# EAGLE design psu_testboard_v1 (1) (1) (EAGLE 6.5.0)

## Sheet 1 of 6
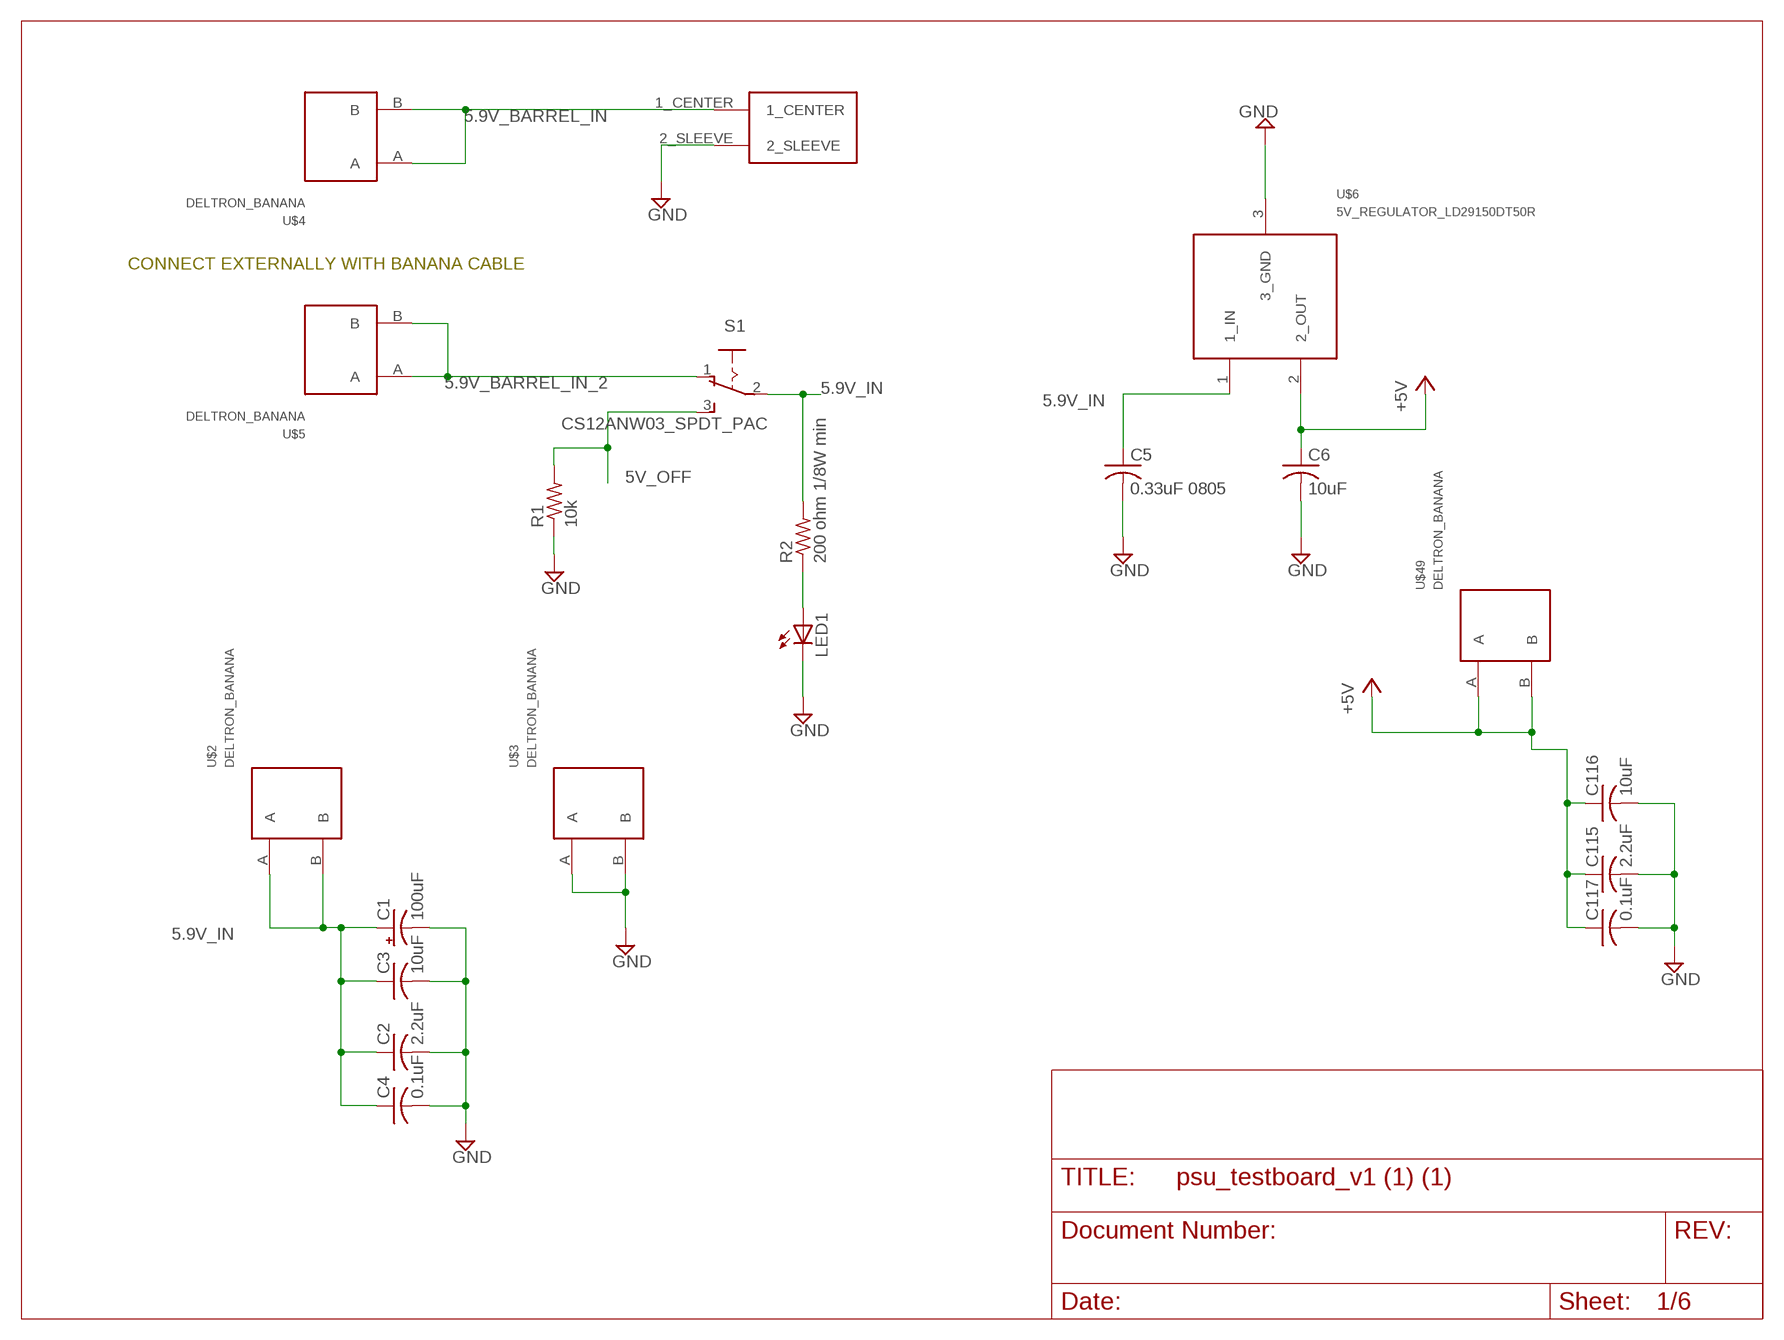
[diagram p0: schematic, sheet 1]

### Parts
C1  100uF  CAP_POL_DEV  [CAP_POL_RADIAL_8MM_3P5MMPAD]
C2  2.2uF  C-USC0603  [C0603]
C3  10uF  C-USC1206  [C1206]
C4  0.1uF  C-USC0603  [C0603]
C5  0.33uF 0805  C-USC0805  [C0805]
C6  10uF  5MM_ELECTROLYTIC_SMT_CAP_EEE-1VA100SR  [5MM_SMT_ELECTROLYTICCAP_PANASONIC]
C115  2.2uF  C-USC0603  [C0603]
C116  10uF  C-USC1206  [C1206]
C117  0.1uF  C-USC0603  [C0603]
LED1  LED3MM  [LED3MM]
R1  10k  R-US_R0603  [R0603]
R2  200 ohm 1/8W min  R-US_R0603  [R0603]
S1  CS12ANW03_SPDT_PAC  [CS12ANW03_NKK_SPDT_SLIDESWITCH_PAC]
U$1  BARREL_JACK_PJ-037A  [BARREL_JACK_PJ-037A]
U$2  DELTRON_BANANA  [DELTRON_BANANA]
U$3  DELTRON_BANANA  [DELTRON_BANANA]
U$4  DELTRON_BANANA  [DELTRON_BANANA]
U$5  DELTRON_BANANA  [DELTRON_BANANA]
U$6  5V_REGULATOR_LD29150DT50R  [DPAK]
U$49  DELTRON_BANANA  [DELTRON_BANANA]

### Nets
5.9V_BARREL_IN: U$1.1_CENTER U$4.A U$4.B
5.9V_BARREL_IN_2: S1.1 U$5.A U$5.B
5.9V_IN: C1.PIN+ C2.1 C3.1 C4.1 C5.1 R2.2 S1.2 U$2.A U$2.B U$6.1(1_IN) ; also sheet 3,4,5
5V_OFF: R1.2 S1.3
+5V: C6.1+ C115.1 C116.1 C117.1 U$6.2(2_OUT) U$49.A U$49.B ; also sheet 3,6
GND: C1.PIN- C2.2 C3.2 C4.2 C5.2 C6.2- C115.2 C116.2 C117.2 LED1.K(C) R1.1 U$1.2_SLEEVE U$3.A U$3.B U$6.3(3_GND) ; also sheet 2,3,4,5,6
N$1: LED1.A R2.1

### Notes on the sheet
- CONNECT EXTERNALLY WITH BANANA CABLE

## Sheet 2 of 6
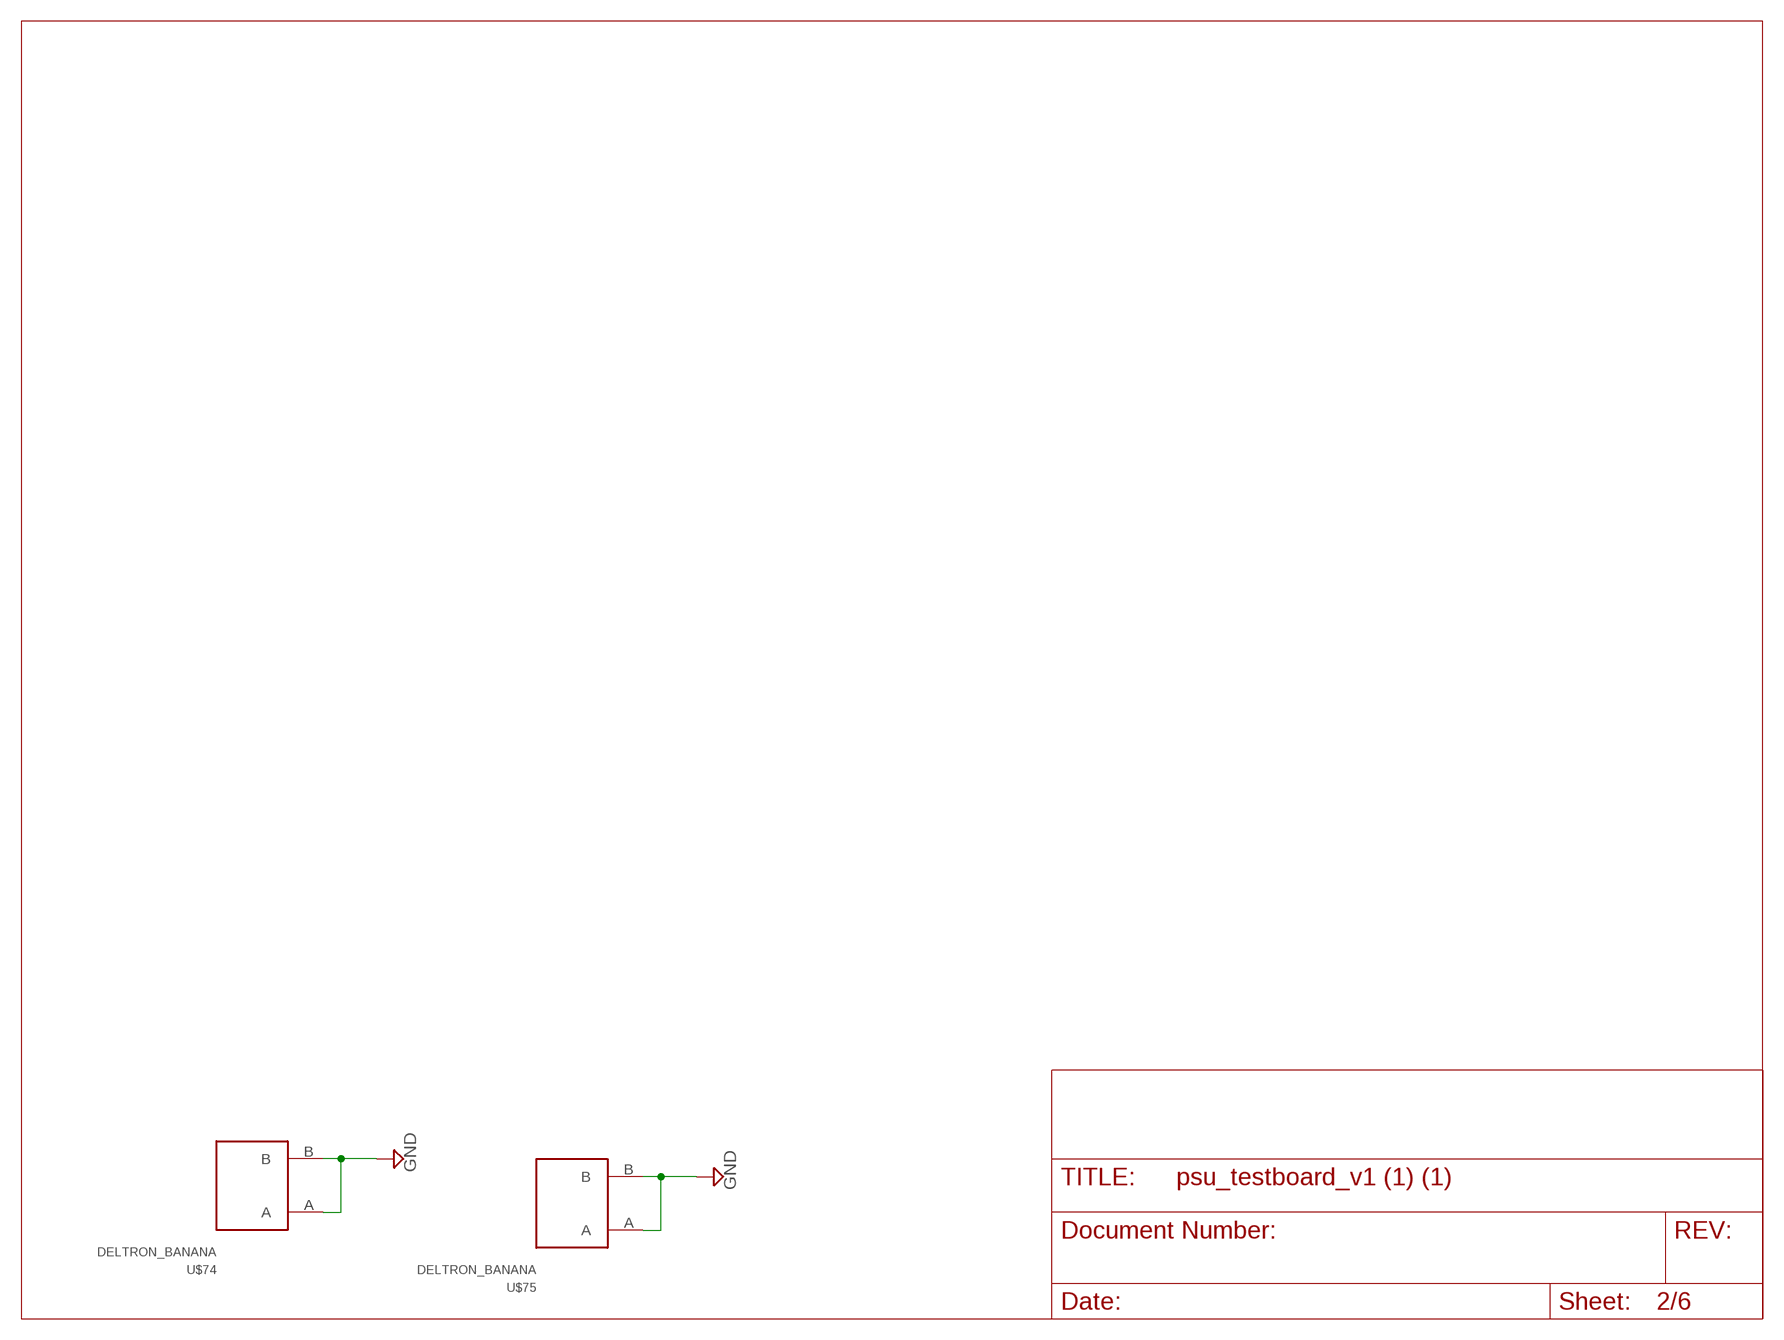
[diagram p1: schematic, sheet 2]

### Parts
U$74  DELTRON_BANANA  [DELTRON_BANANA]
U$75  DELTRON_BANANA  [DELTRON_BANANA]

### Nets
GND: U$74.A U$74.B U$75.A U$75.B ; also sheet 1,3,4,5,6

## Sheet 3 of 6
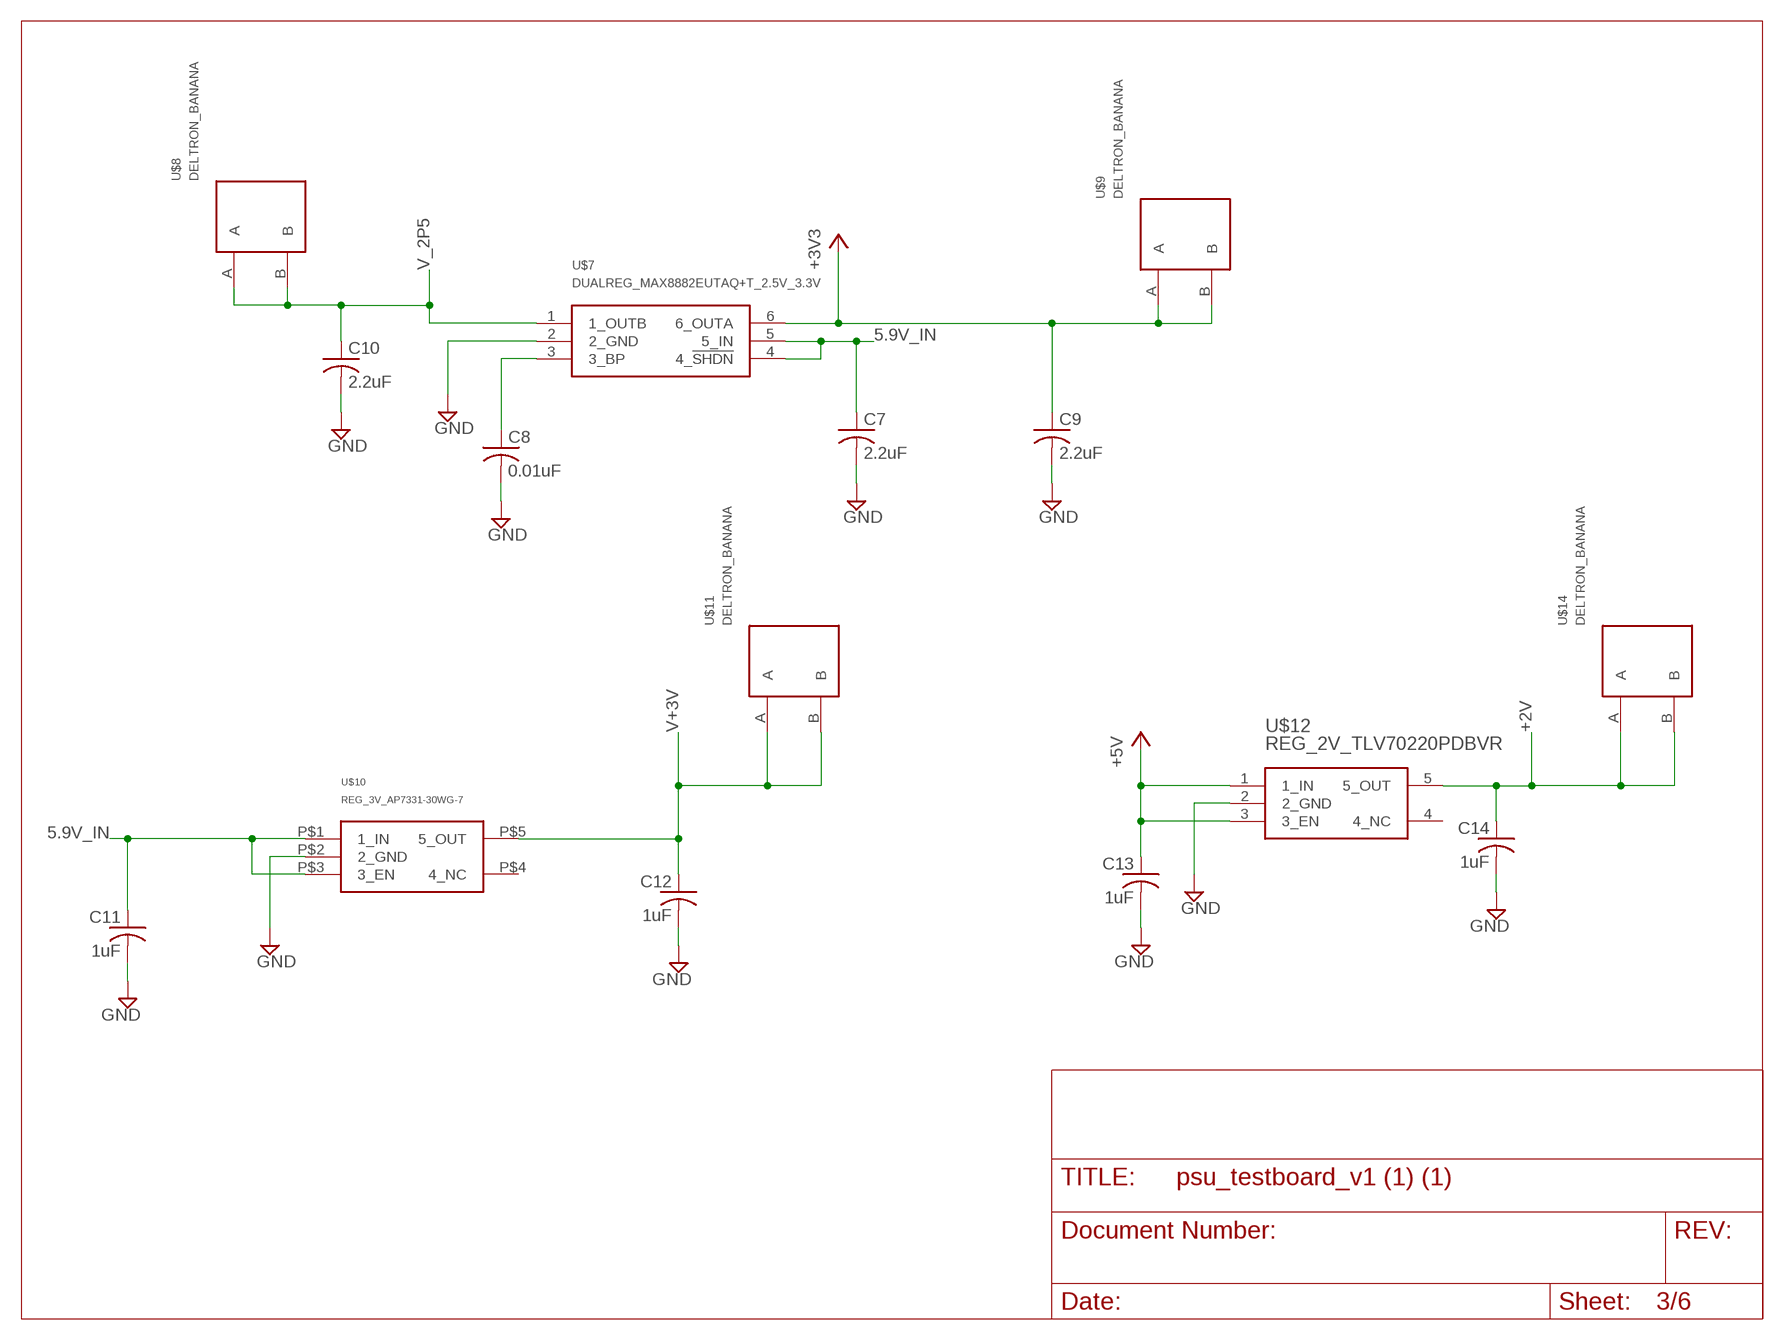
[diagram p2: schematic, sheet 3]

### Parts
C7  2.2uF  C-USC0603  [C0603]
C8  0.01uF  C-USC0603  [C0603]
C9  2.2uF  C-USC0603  [C0603]
C10  2.2uF  C-USC0603  [C0603]
C11  1uF  C-USC0603  [C0603]
C12  1uF  C-USC0603  [C0603]
C13  1uF  C-USC0603  [C0603]
C14  1uF  C-USC0603  [C0603]
U$7  DUALREG_MAX8882EUTAQ+T_2.5V_3.3V  [SOT23-6]
U$8  DELTRON_BANANA  [DELTRON_BANANA]
U$9  DELTRON_BANANA  [DELTRON_BANANA]
U$10  REG_3V_AP7331-30WG-7  [SOT-25]
U$11  DELTRON_BANANA  [DELTRON_BANANA]
U$12  REG_2V_TLV70220PDBVR  [SOT23-5]
U$14  DELTRON_BANANA  [DELTRON_BANANA]

### Nets
5.9V_IN: C7.1 C11.1 U$7.4(4_!SHDN) U$7.5(5_IN) U$10.P$1(1_IN) U$10.P$3(3_EN) ; also sheet 1,4,5
+2V: C14.1 U$12.5(5_OUT) U$14.A U$14.B
+3V3: C9.1 U$7.6(6_OUTA) U$9.A U$9.B ; also sheet 5
+5V: C13.1 U$12.1(1_IN) U$12.3(3_EN) ; also sheet 1,6
GND: C7.2 C8.2 C9.2 C10.2 C11.2 C12.2 C13.2 C14.2 U$7.2(2_GND) U$10.P$2(2_GND) U$12.2(2_GND) ; also sheet 1,2,4,5,6
N$3: C8.1 U$7.3(3_BP)
V+3V: C12.1 U$10.P$5(5_OUT) U$11.A U$11.B
V_2P5: C10.1 U$7.1(1_OUTB) U$8.A U$8.B
Unconnected: U$10.P$4(4_NC) U$12.4(4_NC)

## Sheet 4 of 6
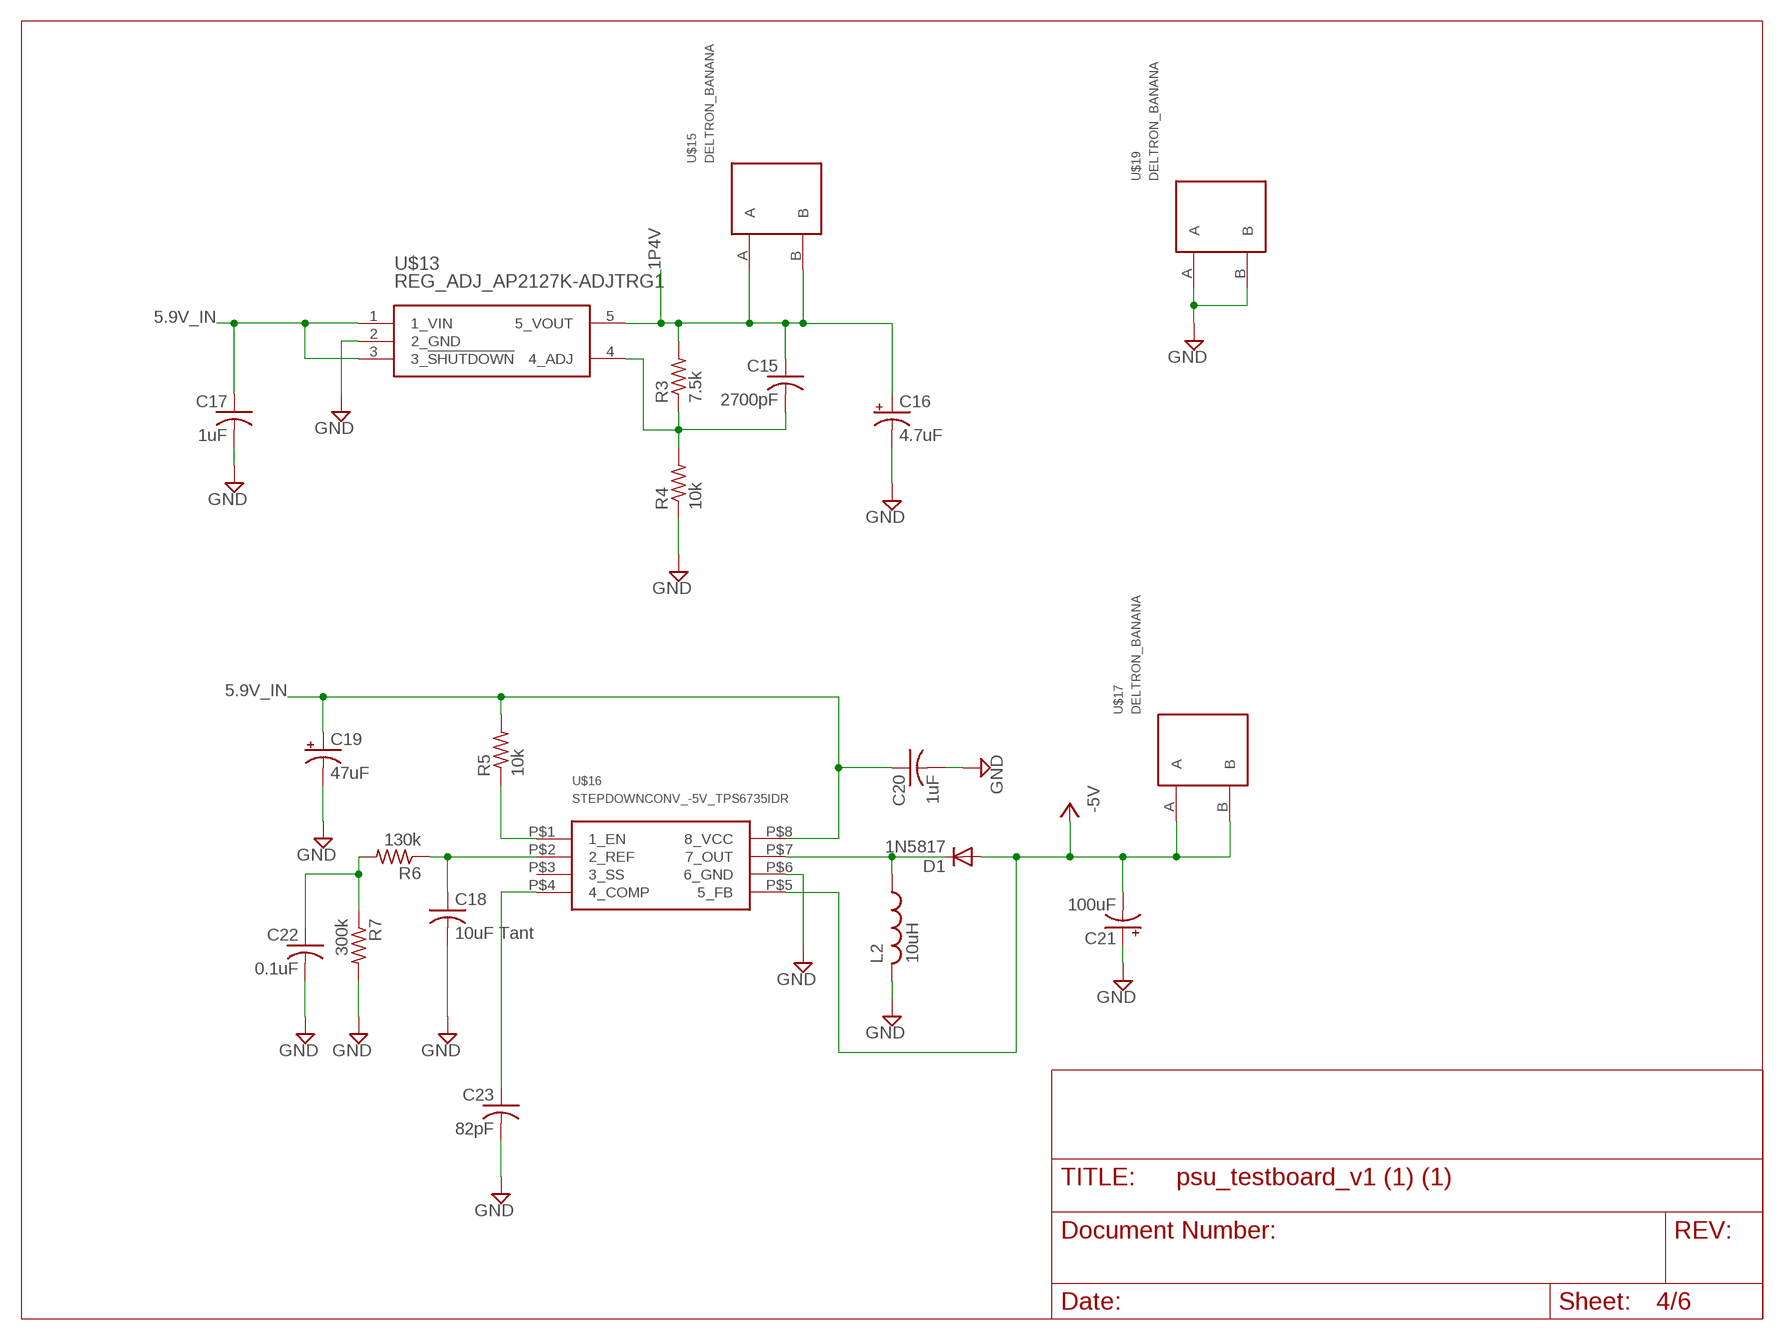
[diagram p3: schematic, sheet 4]

### Parts
C15  2700pF  C-USC0603  [C0603]
C16  4.7uF  CPOL-USE2.5-4V  [E2,5RE]
C17  1uF  C-USC0603  [C0603]
C18  10uF Tant  C-USC1206  [C1206]
C19  47uF  CPOL-USE5-10.5  [E5-10,5]
C20  1uF  C-USC0603  [C0603]
C21  100uF  CPOL-USE2.5-7  [E2,5-7]
C22  0.1uF  C-USC0603  [C0603]
C23  82pF  C-USC0603  [C0603]
D1  1N5817  DIODE1N4148  [DIODE-1N4148]
L2  10uH  COILCRAFT_10UHIND_DO1608C-103MLB  [COILCRAFT_POWERIND_DO1608C-103MLB]
R3  7.5k  R-US_R0603  [R0603]
R4  10k  R-US_R0603  [R0603]
R5  10k  R-US_R0603  [R0603]
R6  130k  R-US_R0603  [R0603]
R7  300k  R-US_R0603  [R0603]
U$13  REG_ADJ_AP2127K-ADJTRG1  [SOT23-5]
U$15  DELTRON_BANANA  [DELTRON_BANANA]
U$16  STEPDOWNCONV_-5V_TPS6735IDR  [SOIC8]
U$17  DELTRON_BANANA  [DELTRON_BANANA]
U$19  DELTRON_BANANA  [DELTRON_BANANA]

### Nets
1P4V: C15.1 C16.+ R3.2 U$13.5(5_VOUT) U$15.A U$15.B
5.9V_IN: C17.1 C19.+ C20.1 R5.2 U$13.1(1_VIN) U$13.3(3_!SHUTDOWN) U$16.P$8(8_VCC) ; also sheet 1,3,5
-5V: C21.- D1.A U$16.P$5(5_FB) U$17.A U$17.B ; also sheet 5
GND: C16.- C17.2 C18.2 C19.- C20.2 C21.+ C22.2 C23.2 L2.P$2 R4.1 R7.2 U$13.2(2_GND) U$16.P$6(6_GND) U$19.A U$19.B ; also sheet 1,2,3,5,6
N$2: D1.C L2.P$1 U$16.P$7(7_OUT)
N$4: C15.2 R3.1 R4.2 U$13.4(4_ADJ)
N$5: R5.1 U$16.P$1(1_EN)
N$6: C22.1 R6.2 R7.1
N$7: C18.1 R6.1 U$16.P$2(2_REF)
N$8: C23.1 U$16.P$4(4_COMP)
Unconnected: U$16.P$3(3_SS)

## Sheet 5 of 6
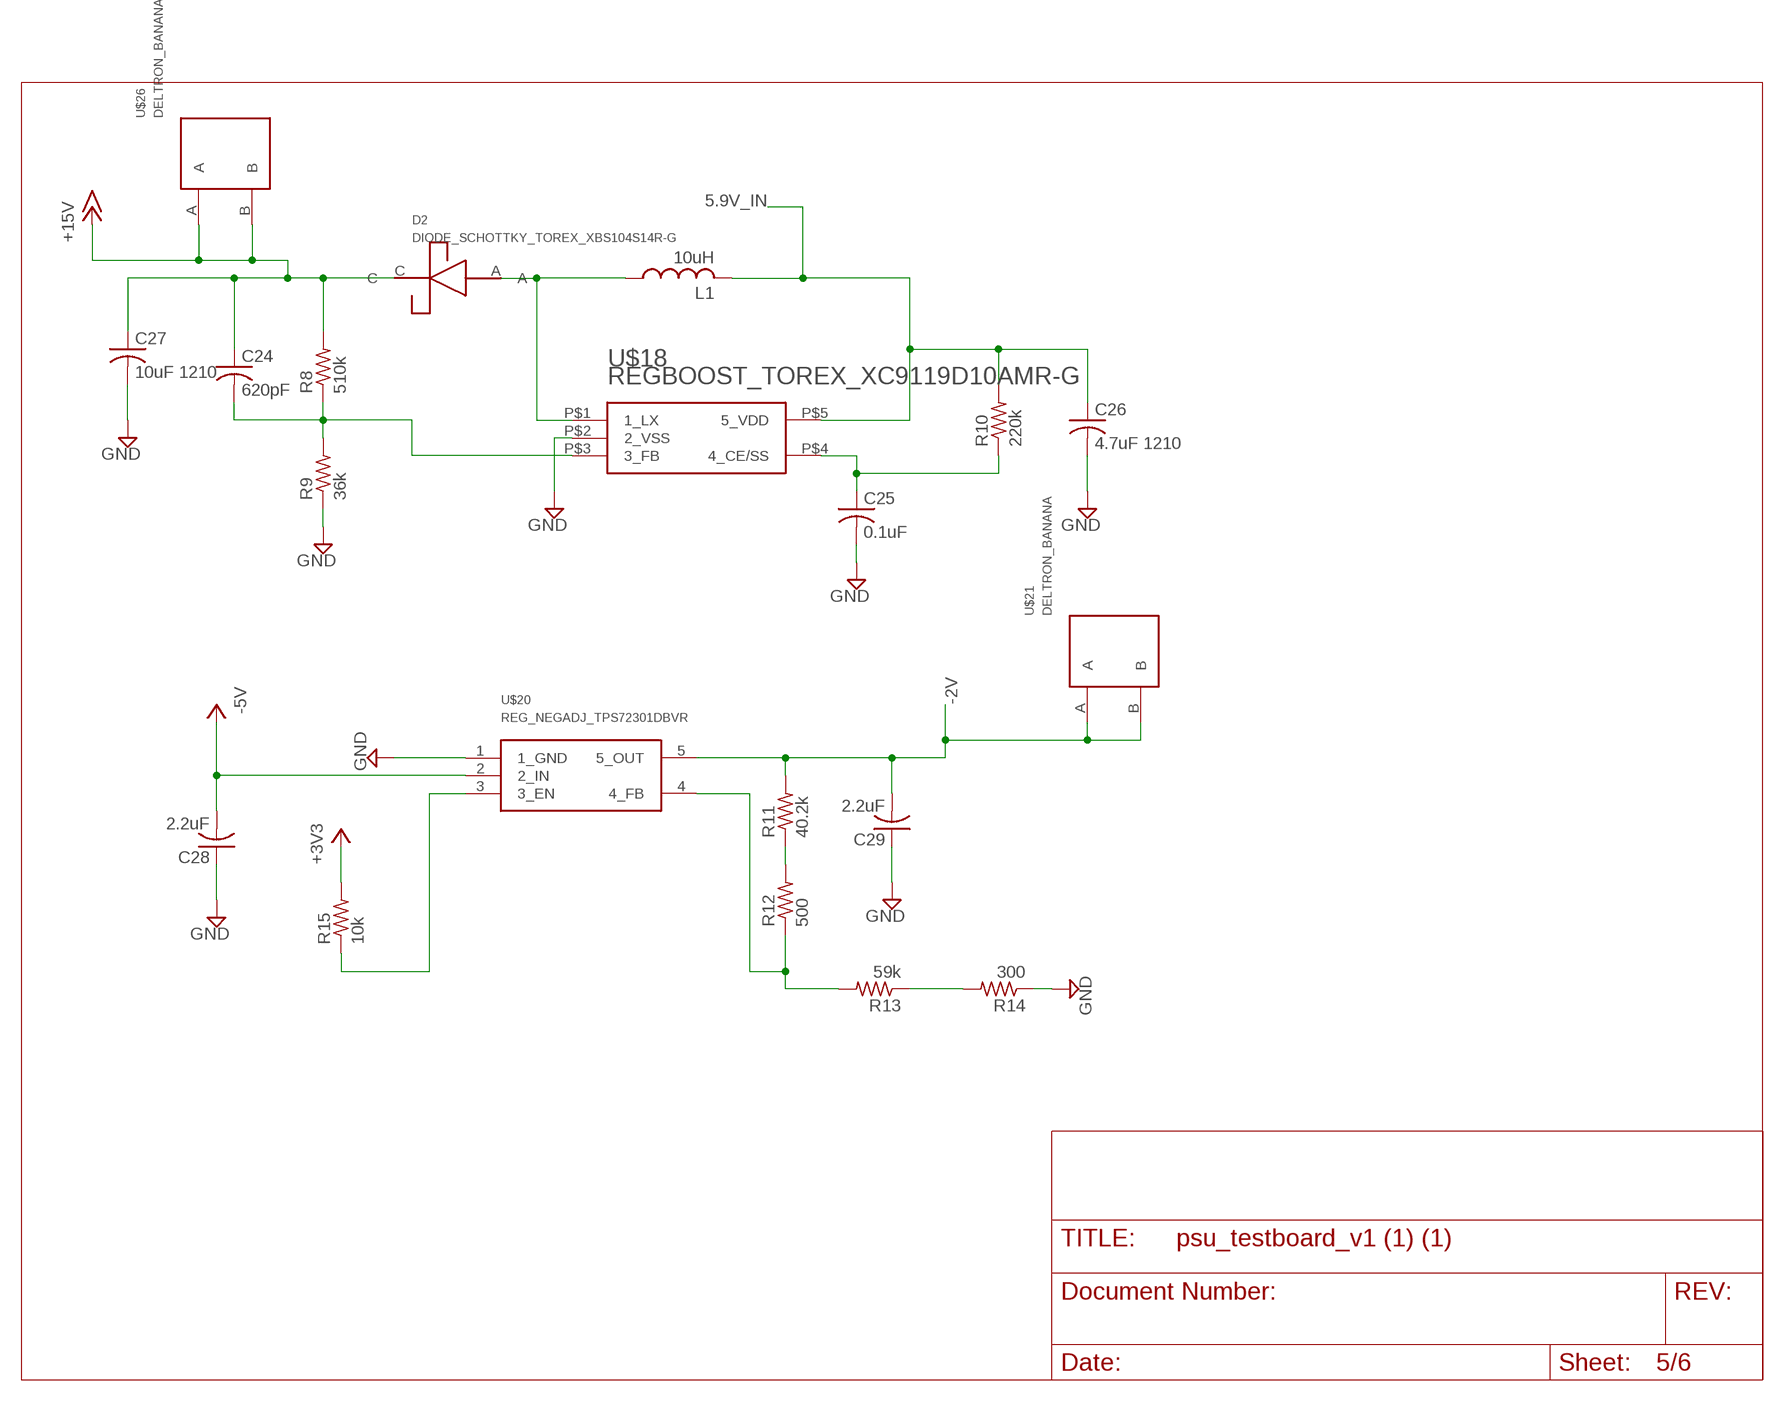
[diagram p4: schematic, sheet 5]

### Parts
C24  620pF  C-USC0603  [C0603]
C25  0.1uF  C-USC0603  [C0603]
C26  4.7uF 1210  C-USC1210  [C1210]
C27  10uF 1210  C-USC1210  [C1210]
C28  2.2uF  C-USC0603  [C0603]
C29  2.2uF  C-USC0603  [C0603]
D2  DIODE_SCHOTTKY_TOREX_XBS104S14R-G  [SOD-123A]
L1  10uH  SUMIDA_10UH_IND_CDRH4D18CNP-100PC  [SUMIDA_INDUCTOR_CDRH4D18CNP-100PC]
R8  510k  R-US_R0603  [R0603]
R9  36k  R-US_R0603  [R0603]
R10  220k  R-US_R0603  [R0603]
R11  40.2k  R-US_R0603  [R0603]
R12  500  R-US_R0603  [R0603]
R13  59k  R-US_R0603  [R0603]
R14  300  R-US_R0603  [R0603]
R15  10k  R-US_R0603  [R0603]
U$18  REGBOOST_TOREX_XC9119D10AMR-G  [SOT25-5]
U$20  REG_NEGADJ_TPS72301DBVR  [SOT23-5]
U$21  DELTRON_BANANA  [DELTRON_BANANA]
U$26  DELTRON_BANANA  [DELTRON_BANANA]

### Nets
5.9V_IN: C26.1 L1.P$2 R10.2 U$18.P$5(5_VDD) ; also sheet 1,3,4
+3V3: R15.2 ; also sheet 3
+15V: C24.1 C27.1 D2.C R8.2 U$26.A U$26.B
-2V: C29.2 R11.2 U$20.5(5_OUT) U$21.A U$21.B
-5V: C28.2 U$20.2(2_IN) ; also sheet 4
GND: C25.2 C26.2 C27.2 C28.1 C29.1 R9.1 R14.1 U$18.P$2(2_VSS) U$20.1(1_GND) ; also sheet 1,2,3,4,6
N$9: R13.1 R14.2
N$10: D2.A L1.P$1 U$18.P$1(1_LX)
N$12: C24.2 R8.1 R9.2 U$18.P$3(3_FB)
N$13: R12.1 R13.2 U$20.4(4_FB)
N$14: C25.1 R10.1 U$18.P$4(4_CE/SS)
N$15: R11.1 R12.2
N$16: R15.1 U$20.3(3_EN)

## Sheet 6 of 6
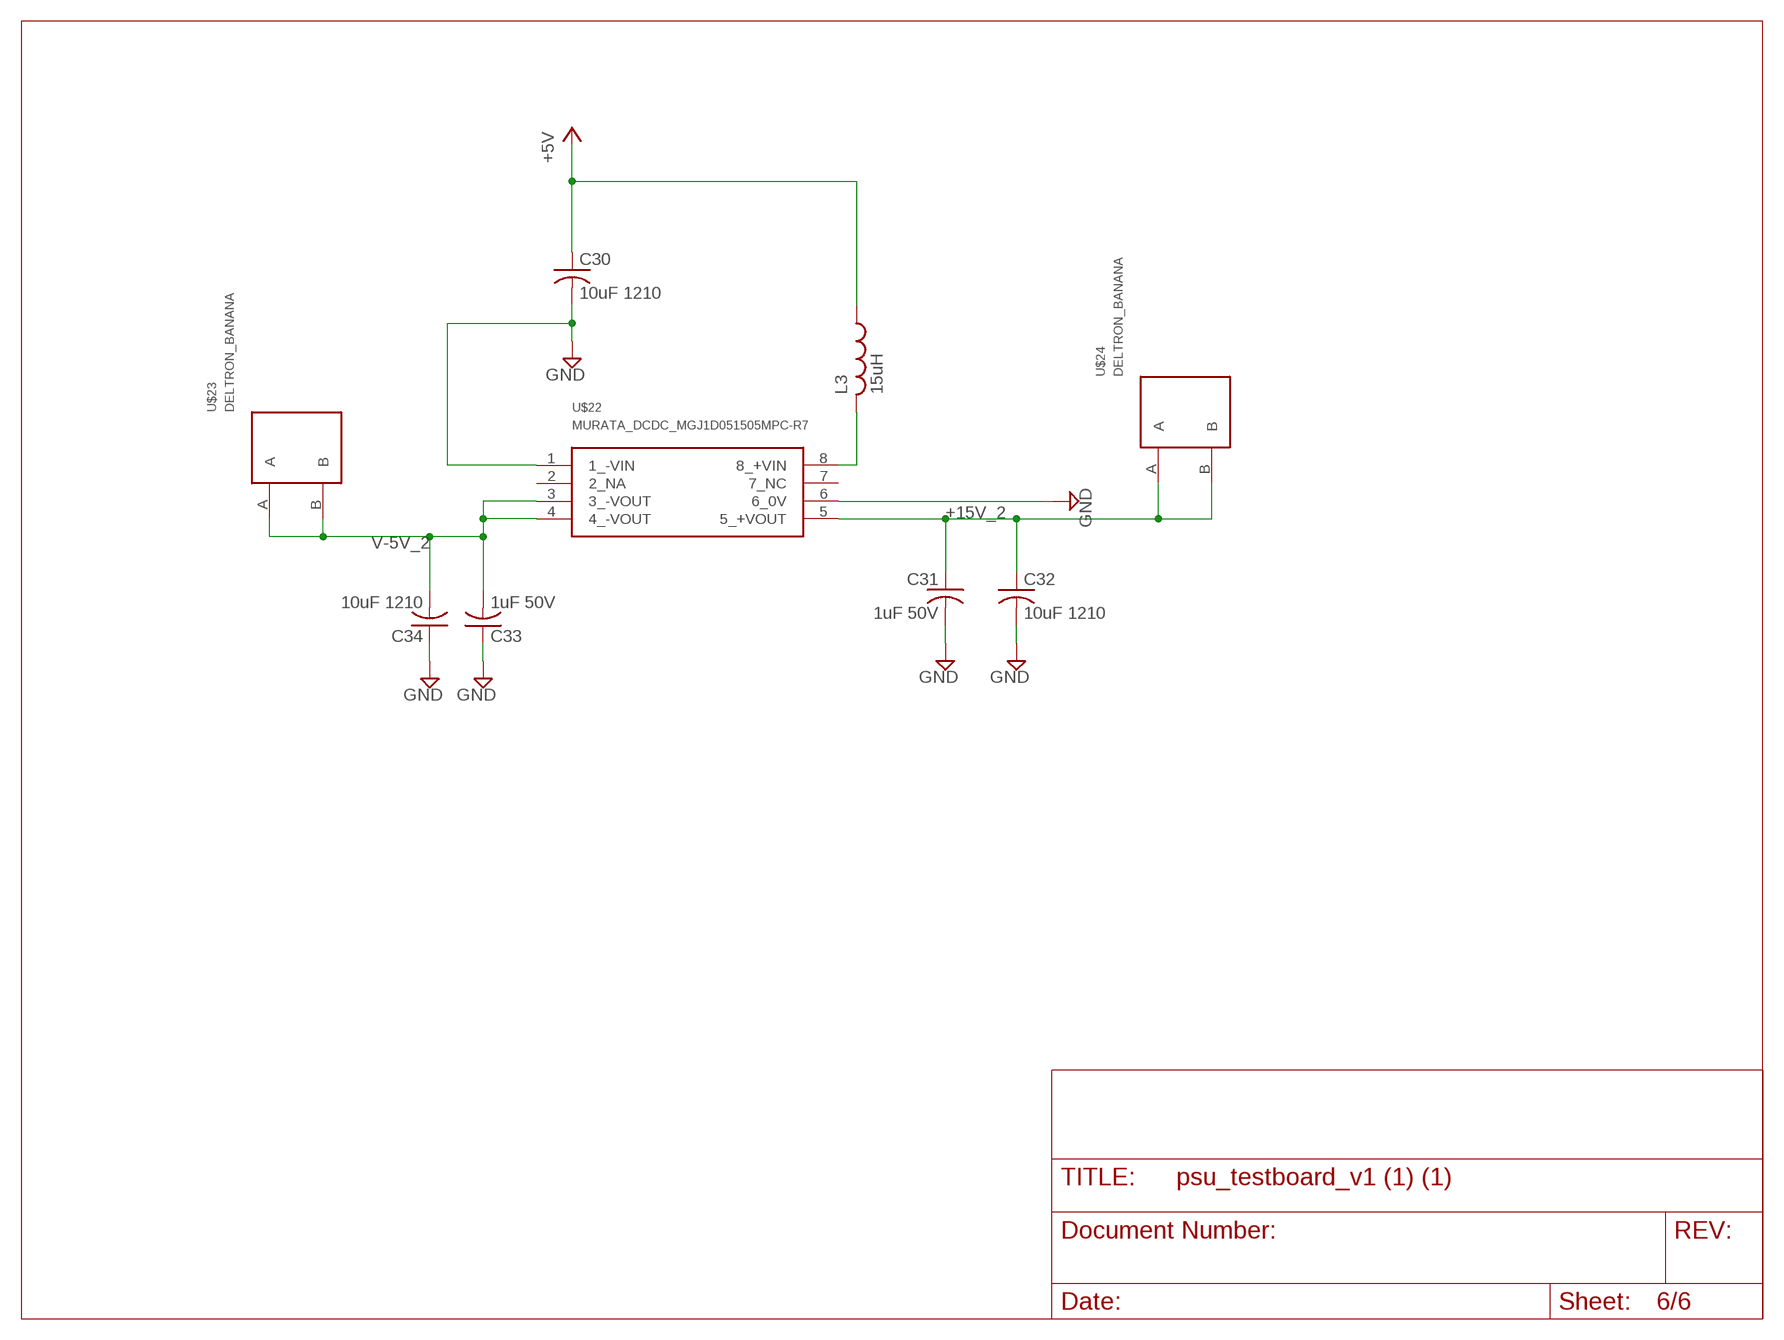
[diagram p5: schematic, sheet 6]

### Parts
C30  10uF 1210  C-USC1210  [C1210]
C31  1uF 50V  C-USC0603  [C0603]
C32  10uF 1210  C-USC1210  [C1210]
C33  1uF 50V  C-USC0603  [C0603]
C34  10uF 1210  C-USC1210  [C1210]
L3  15uH  L-US0207/5V  [0207/5V]
U$22  MURATA_DCDC_MGJ1D051505MPC-R7  [MURATA_DCDC_MGJ1D051505MPC-R7]
U$23  DELTRON_BANANA  [DELTRON_BANANA]
U$24  DELTRON_BANANA  [DELTRON_BANANA]

### Nets
+5V: C30.1 L3.1 ; also sheet 1,3
+15V_2: C31.1 C32.1 U$22.5(5_+VOUT) U$24.A U$24.B
GND: C30.2 C31.2 C32.2 C33.1 C34.1 U$22.1(1_-VIN) U$22.6(6_0V) ; also sheet 1,2,3,4,5
N$17: L3.2 U$22.8(8_+VIN)
V-5V_2: C33.2 C34.2 U$22.3(3_-VOUT) U$22.4(4_-VOUT) U$23.A U$23.B
Unconnected: U$22.2(2_NA) U$22.7(7_NC)

## Library data of the parts
C1 = RF_servo_SA032212:CAP_POL_DEV: Polarized Capacitor Created on : 03.24.2012 Created by: Serhan Ardanuc
C2-C5 C7-C15 C17 C18 C20 C22-C34 C115-C117 = rcl:C-US: CAPACITOR, American symbol
C6 = fp64v2lib:5MM_ELECTROLYTIC_SMT_CAP_EEE-1VA100SR
C16 C19 C21 = rcl:CPOL-US: POLARIZED CAPACITOR, American symbol
D1 = SparkFun:DIODE: Diode These are standard reverse protection diodes and small signal diodes. SMA package can handle up to about 1A. SOD-323 can handle about 200mA. What the SOD-323 package when ordering, there are some mfgs out there that are 5-pin packages.
D2 = fp64v2lib:DIODE_SCHOTTKY_TOREX_XBS104S14R-G: Mouser part no: 865-XBS104S14R-G
L1 = fp64v2lib:SUMIDA_10UH_IND_CDRH4D18CNP-100PC: Digikey Part No: 308-1656-1-ND
L2 = fp64v2lib:COILCRAFT_10UHIND_DO1608C-103MLB: Mouser part no: 994-DO1608C-103MLB
L3 = rcl:L-US: INDUCTOR, American symbol
LED1 = SparkFun:LED: LEDs Standard schematic elements and footprints for 5mm, 3mm, 1206, and 0603 sized LEDs. 5mm - Spark Fun Electronics SKU : COM-00529 (and others)
R1-R15 = rcl:R-US_: RESISTOR, American symbol
S1 = RF_servo_SA032212:CS12ANW03_SPDT_PAC: SPDT Switch
U$1 = hsadc_lib1:BARREL_JACK_PJ-037A
U$2-U$5 U$8 U$9 U$11 U$14 U$15 U$17 U$19 U$21 U$23 U$24 U$26 U$49 U$74 U$75 = tic_lib_3:DELTRON_BANANA
U$6 = fp64v2lib:5V_REGULATOR_LD29150DT50R: 5V Regulator Digikey Part No: 497-3468-1-ND
U$7 = fp64v2lib:DUALREG_MAX8882EUTAQ+T_2.5V_3.3V: Digikey part no: MAX8882EUTAQ+TCT-ND
U$10 = fp64v2lib:REG_3V_AP7331-30WG-7: Digikey part no: AP7331-30WG-7DICT-ND
U$12 = fp64v2lib:REG_2V_TLV70220PDBVR
U$13 = fp64v2lib:REG_ADJ_AP2127K-ADJTRG1: Digikey Part No: AP2127K-ADJTRG1DICT-ND
U$16 = fp64v2lib:STEPDOWNCONV_-5V_TPS6735IDR: Digikey: 296-10982-1-ND
U$18 = fp64v2lib:REGBOOST_TOREX_XC9119D10AMR-G: Digikey Part no: 893-1165-1-ND
U$20 = fp64v2lib:REG_NEGADJ_TPS72301DBVR: Digikey Part no:296-27049-1-ND
U$22 = fp64v2lib:MURATA_DCDC_MGJ1D051505MPC-R7

## Board
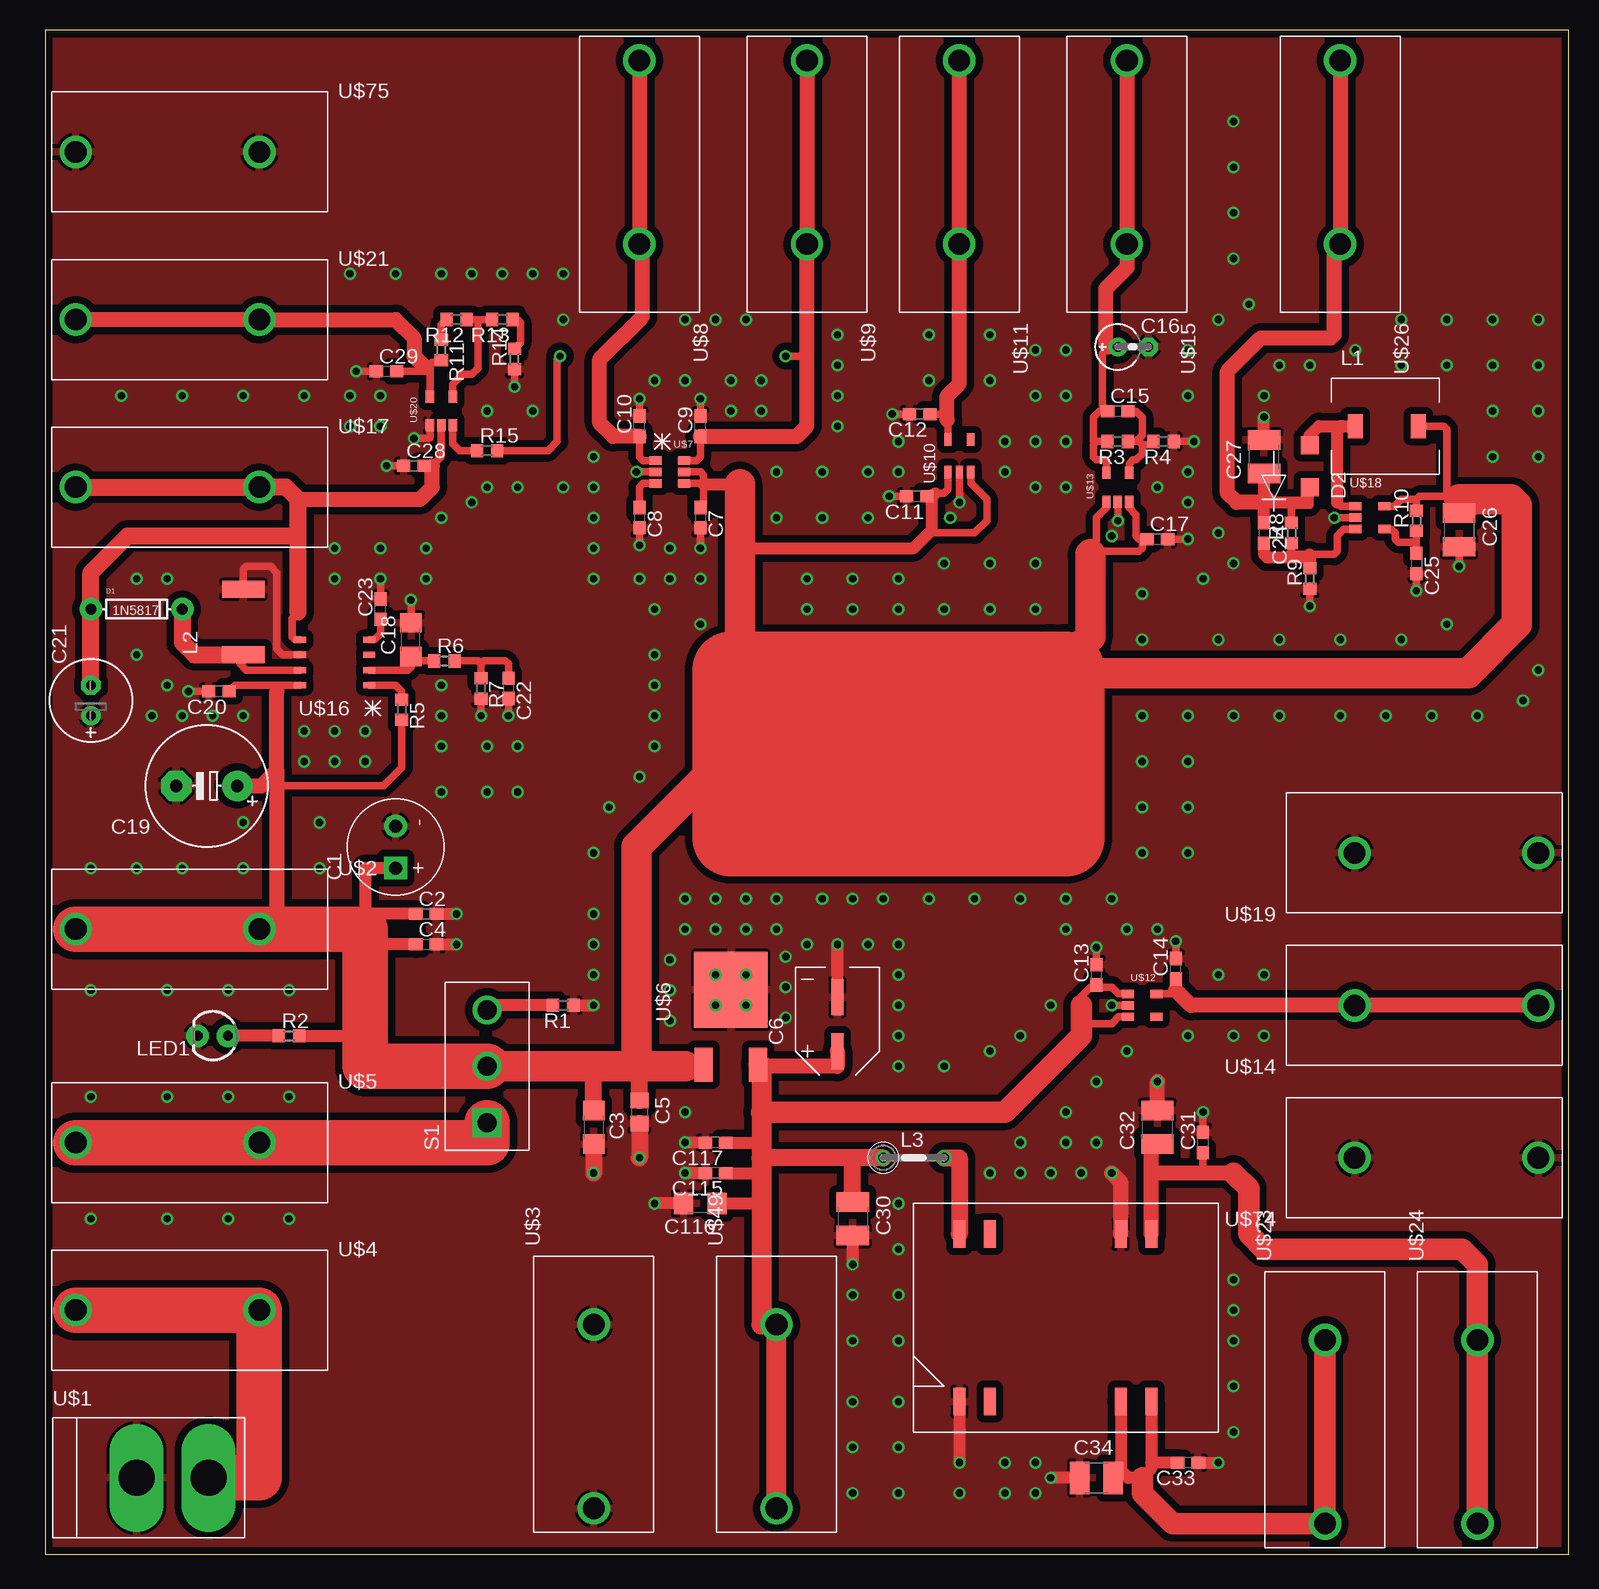
[diagram p6: board, top side]
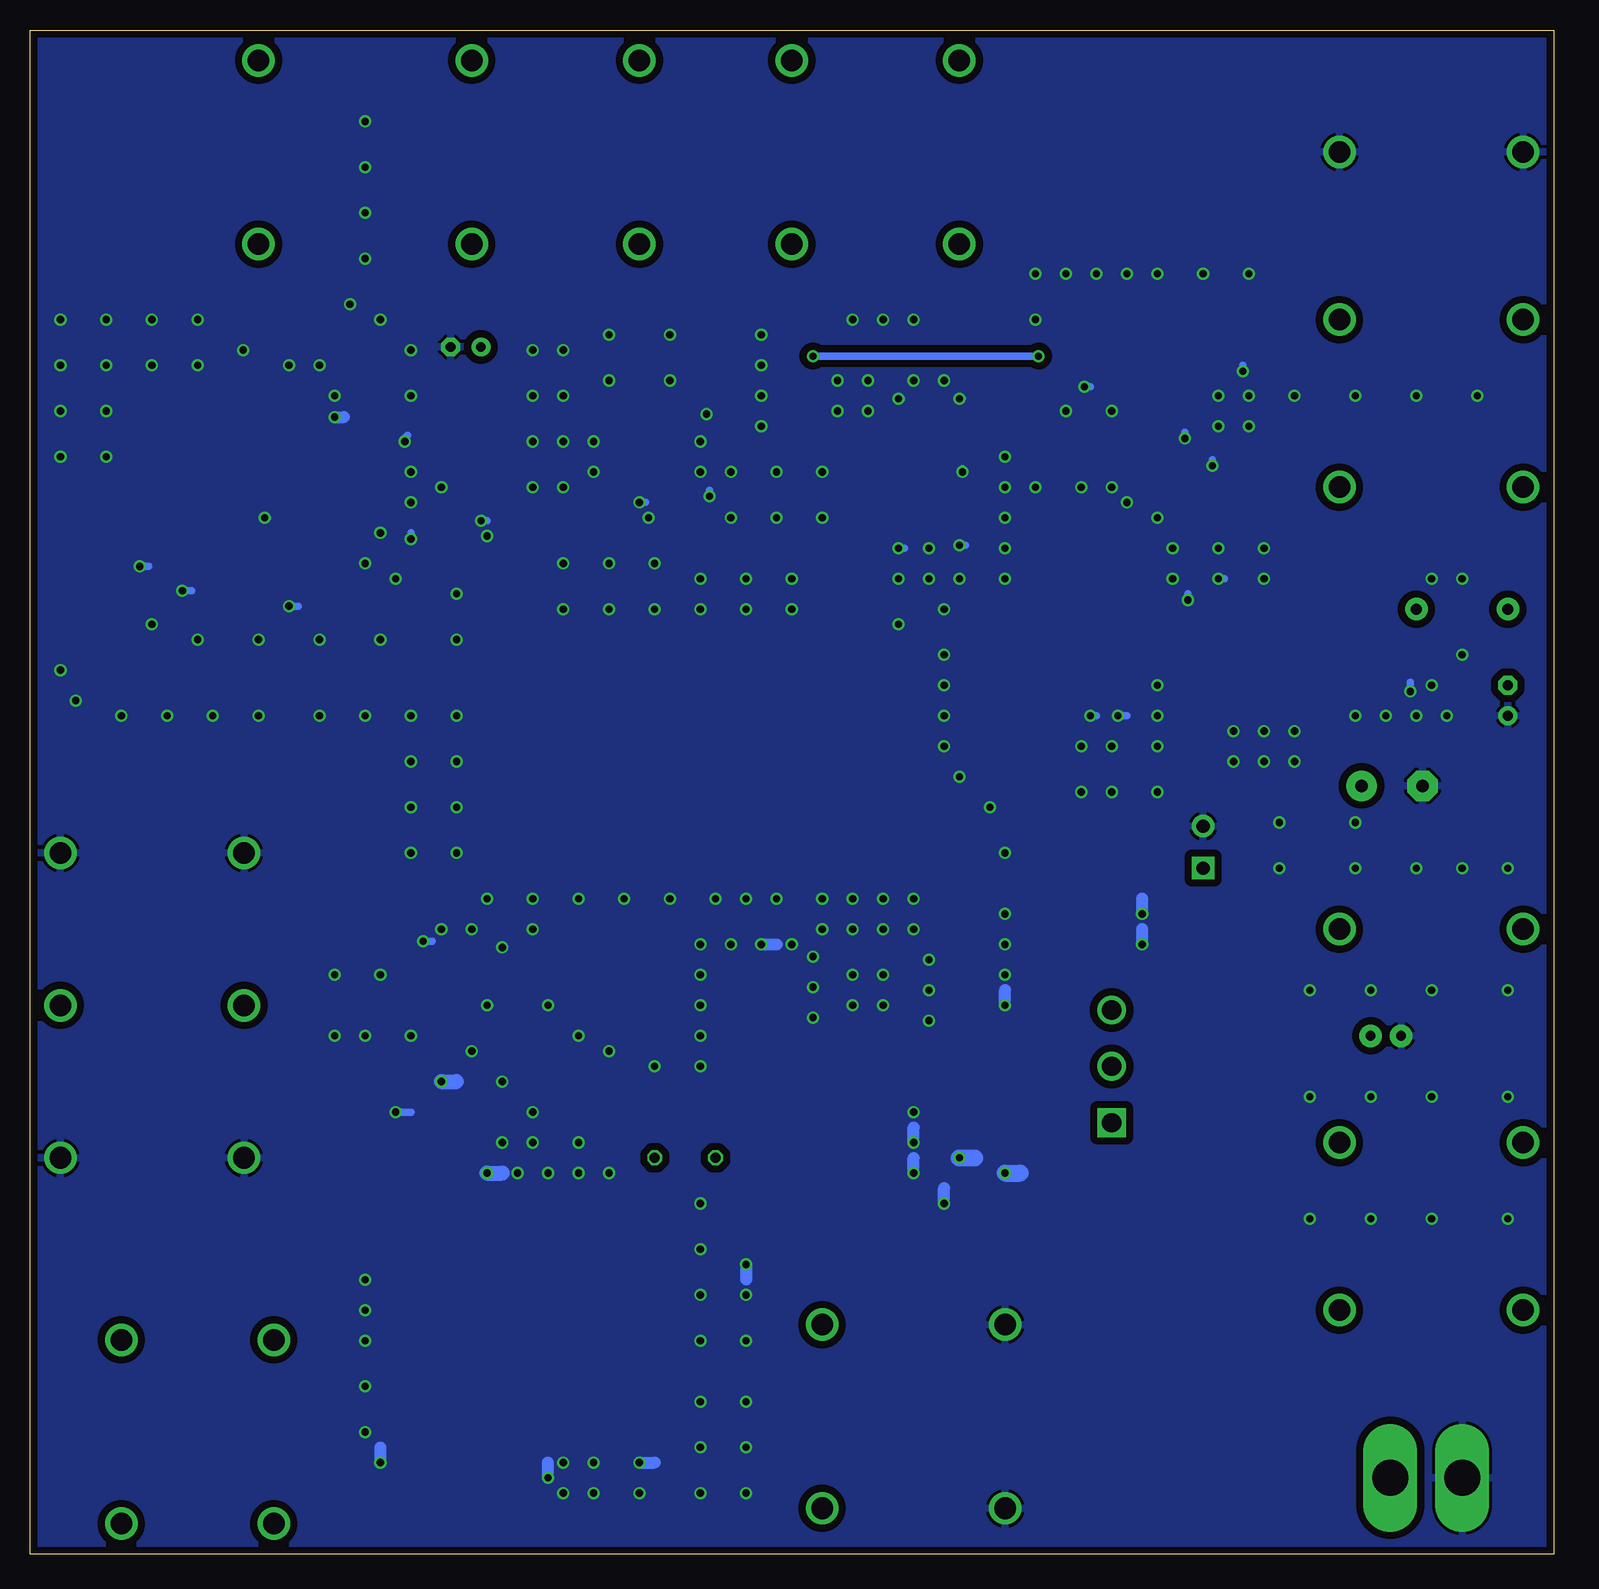
[diagram p7: board, bottom side, seen from below]

Size 127 x 127 mm. Coordinates in mm from the lower left corner, seen from the top.
Outline: 0,0 127,0 127,127 0,127 0,0
Copper layers (1*16): Top 0.0178mm / dielectric 59mil / Bottom 0.0178mm
Design rules "SSC-EAGLE-2Lyr_v1.0.0.3": minimum track width 6mil, minimum drill 14mil, track to track 6mil, track to pad 6mil, pad to pad 6mil, via to via 6mil, smd to smd 6mil, copper to edge 20mil, drill to drill 16mil, minimum pad ring 8mil, minimum via ring 8mil, stop-mask expansion 3mil, vias tented up to drill 0mil, thermal gap 10mil

### Footprints (pad centres in the part's own frame; a part is rotated, then mirrored left to right if it is on the bottom)
CAP_POL_RADIAL_8MM_3P5MMPAD = drill 1.087 pad 1.88 square: PIN+ 0,0 | drill 1.087 pad 1.88: PIN- 3.5,0
C0603 = smd 1.1 x 1: 1 -0.85,0; 2 0.85,0
C1206 = smd 1.6 x 1.8: 1 -1.4,0; 2 1.4,0
C0805 = smd 1.3 x 1.5: 1 -0.95,0; 2 0.95,0
5MM_SMT_ELECTROLYTICCAP_PANASONIC = smd 1 x 3: 1+ 0,0; 2- 0,4.5
E2,5RE = drill 0.813 pad 1.575: + -1.27,0 | drill 0.813 pad 1.575 octagon: - 1.27,0
E5-10,5 = drill 1.016 pad 2.54: + -2.54,0 | drill 1.016 pad 2.54 octagon: - 2.54,0
E2,5-7 = drill 0.813 pad 1.6: + -1.27,0 | drill 0.813 pad 1.6 octagon: - 1.27,0
C1210 = smd 1.6 x 2.7: 1 -1.4,0; 2 1.4,0
DIODE-1N4148 = drill 0.9 pad 1.88: A -3.81,0; C 3.81,0
SOD-123A = smd 1.5 x 1.5: A 3.5,0; C 0,0
SUMIDA_INDUCTOR_CDRH4D18CNP-100PC = smd 1.25 x 2: P$1 0,0; P$2 5.25,0
COILCRAFT_POWERIND_DO1608C-103MLB = smd 1.397 x 3.556: P$1 0,0; P$2 5.461,0
0207/5V = drill 0.813 octagon: 1 -2.54,0; 2 2.54,0
LED3MM = drill 0.813 pad 1.88: A -1.27,0; K 1.27,0
R0603 = smd 1 x 1.1: 1 -0.85,0; 2 0.85,0
CS12ANW03_NKK_SPDT_SLIDESWITCH_PAC = drill 1.6 square: 1 0,-4.7 | drill 1.6: 2 0,0; 3 0,4.7
BARREL_JACK_PJ-037A = drill 3 long: 1_CENTER 6,0; 2_SLEEVE 0,0
DELTRON_BANANA = drill 1.8: A 0,0; B 15.3,0
DPAK = smd 1.5 x 2.8: 1 -2.286,1.4; 2 2.286,1.4 | smd 6.1 x 6.3: 3 0,7.65
SOT23-6 = smd 0.7 x 1: 1 -0.95,-1.2; 2 0,-1.2; 3 0.95,-1.2; 4 0.95,1.2; 5 0,1.2; 6 -0.95,1.2
SOT-25 = smd 0.6 x 1.05: P$1 -0.95,0; P$2 0,0; P$3 0.95,0; P$4 0.95,2.7; P$5 -0.95,2.7
SOT23-5 = smd 0.7 x 1: 1 -0.95,-1.2; 2 0,-1.2; 3 0.95,-1.2; 4 0.95,1.2; 5 -0.95,1.2
SOIC8 = smd 0.991 x 0.508: P$1 -2.87,1.27; P$2 -2.87,0; P$3 -2.87,-1.27; P$4 -2.87,-2.54; P$5 2.87,-2.54; P$6 2.87,-1.27; P$7 2.87,0; P$8 2.87,1.27
SOT25-5 = smd 0.7 x 1: P$1 -0.95,0; P$2 0,0; P$3 0.95,0; P$4 0.95,2.4; P$5 -0.95,2.4
MURATA_DCDC_MGJ1D051505MPC-R7 = smd 1 x 2.3: 1 0,0; 2 2.54,0; 3 13.46,0; 4 16,0; 5 16,13.97; 6 13.46,13.97; 7 2.54,13.97; 8 0,13.97

### Placement (x,y rotation side)
C1  29.21,57.15 90 top
C2  31.75,53.34 0 top
C3  45.72,35.56 270 top
C4  31.75,50.8 0 top
C5  49.53,36.83 270 top
C6  66.04,41.91 0 top
C7  54.61,86.36 270 top
C8  49.53,86.36 270 top
C9  54.61,93.98 90 top
C10  49.53,93.98 90 top
C11  72.64,88.14 180 top
C12  72.9,95 180 top
C13  87.63,48.26 90 top
C14  94.23,48.77 90 top
C15  89.41,95.25 0 top
C16  90.68,100.58 0 top
C17  92.71,84.58 0 top
C18  30.48,76.2 90 top
C19  13.46,64.01 180 top
C20  14.48,71.88 180 top
C21  3.81,71.12 90 top
C22  38.61,72.14 270 top
C23  27.94,78.74 90 top
C24  101.6,85.09 270 top
C25  114.3,82.55 270 top
C26  117.86,85.34 270 top
C27  101.6,91.44 90 top
C28  30.73,90.68 0 top
C29  28.45,98.55 0 top
C30  67.31,27.94 270 top
C31  96.52,34.29 90 top
C32  92.71,35.56 90 top
C33  95.25,7.62 180 top
C34  87.63,6.35 0 top
C115  55.88,31.75 180 top
C116  54.61,29.21 180 top
C117  55.88,34.29 180 top
D1  7.62,78.74 0 top
D2  105.41,88.9 90 top
L1  109.22,93.98 0 top
L2  16.51,74.93 90 top
L3  72.39,33.02 0 top
LED1  13.97,43.18 180 top
R1  43.18,45.72 180 top
R2  20.32,43.18 0 top
R3  89.41,92.71 180 top
R4  93.22,92.71 180 top
R5  29.72,70.36 270 top
R6  33.27,74.42 0 top
R7  36.32,72.14 270 top
R8  103.89,85.09 90 top
R9  105.41,81.28 90 top
R10  114.3,86.11 90 top
R11  33.02,100.33 270 top
R12  34.29,102.87 180 top
R13  38.1,102.87 180 top
R14  39.12,99.57 90 top
R15  36.83,91.95 0 top
S1  36.83,40.64 0 top
U$1  7.62,6.35 0 top
U$2  2.54,52.07 0 top
U$3  45.72,3.81 90 top
U$4  2.54,20.32 0 top
U$5  2.54,34.29 0 top
U$6  57.15,39.37 0 top
U$7  52.07,90.17 270 top
U$8  49.53,124.46 270 top
U$9  63.5,124.46 270 top
U$10  76.2,90.17 0 top
U$11  76.2,124.46 270 top
U$12  91.44,45.72 270 top
U$13  89.41,88.9 0 top
U$14  124.46,45.72 180 top
U$15  90.17,124.46 270 top
U$16  24.13,73.66 180 top
U$17  2.54,88.9 0 top
U$18  109.22,86.36 270 top
U$19  124.46,58.42 180 top
U$20  33.02,95.25 0 top
U$21  2.54,102.87 0 top
U$22  76.2,12.7 0 top
U$23  106.68,2.54 90 top
U$24  119.38,2.54 90 top
U$26  107.95,124.46 270 top
U$49  60.96,3.81 90 top
U$74  124.46,33.02 180 top
U$75  2.54,116.84 0 top

### Tracks (layer width: path | path; a pad name or v marks a point on that pad's centre or on a via)
1P4V
  Top 0.61: U$13.5 88.46,91.12 88.39,91.19 87.63,91.19 87.38,91.44 87.38,92.46 87.5,92.58 | 87.5,92.58 87.63,92.71 R3.2 | 87.5,92.58 87.38,92.71 87.38,94.74 87.88,95.25 C15.1 88.14,95.67 88.14,100.08 88.65,100.58 C16.+
  Top 1.27: 88.65,100.58 88.39,100.84 88.39,105.41 90.17,107.19 U$15.B U$15.A
5.9V_BARREL_IN
  Top 3.81: U$1.1_CENTER 17.84,6.35 U$4.B U$4.A
5.9V_BARREL_IN_2
  Top 3.81: U$5.A U$5.B 36.83,34.29 S1.1
5.9V_IN
  Top 0.61: U$16.P$8 19.56,72.39 | 19.56,72.39 15.84,72.39 C20.1 | 19.3,71.88 19.3,72.14 19.56,72.39 | R5.2 29.72,65.53 28.19,64.01 19.56,64.01 19.3,64.26 | U$7.5 54.61,90.17 54.86,89.92 54.86,89.15 54.86,88.9 | 54.86,88.9 54.86,87.46 C7.1 | U$7.4 54.54,89.22 54.86,88.9 | U$10.P$1 75.25,88.71 74.93,88.39 74.17,88.39 73.75,88.39 C11.1 | U$10.P$3 77.15,89.22 78.49,87.88 78.49,86.11 77.47,85.09 74.17,85.09 73.91,85.34 | U$13.3 90.36,87.19 90.93,86.61 90.93,84.84 91.19,84.58 C17.1 91.44,84.16 91.44,83.82 91.19,83.57 88.14,83.57 | U$13.1 88.46,87.19 87.63,86.36 87.63,84.07 88.14,83.57 | 114.3,87.88 R10.2 | C26.1 117.86,87.88 117.6,88.14 116.84,88.14 | 116.84,88.14 114.55,88.14 114.3,87.88 | L1.P$2 116.59,93.98 116.84,93.73 116.84,88.14 | 88.14,83.57 87.38,83.57 87.12,83.31 | U$18.P$5 112.46,87.31 113.03,87.88 114.3,87.88
  Top 1.016: R2.2 26.67,43.18 | C4.1 27.94,50.8 27.94,52.07 26.67,52.07 26.67,53.34 | C2.1 26.67,53.34 | C1.PIN+ 26.67,57.15 26.67,53.34 | 54.86,89.15 57.91,89.15 57.91,84.33 58.42,83.82 72.39,83.82 73.91,85.34 73.91,88.14 74.17,88.39
  Top 1.27: C19.+ 18.03,64.01 19.3,65.28 | 19.3,65.28 19.3,71.88 | 19.3,65.28 19.3,64.26 19.3,52.32 19.56,52.07 | 84.58,73.91 84.58,74.17 83.82,74.93 83.82,73.66
  Top 1.422: 53.34,40.64 54.86,40.64 U$6.1 | C3.1 45.72,40.64 | C5.1 49.53,40.64
  Top 2.54: S1.2 45.72,40.64 49.28,40.64 | 49.28,40.64 49.53,40.64 53.34,40.64 | 57.91,89.15 57.91,74.17 | 57.91,74.17 57.91,67.56 49.28,58.93 49.28,40.64 | 87.12,83.31 87.12,76.45 84.96,74.3 | 84.96,74.3 84.58,73.91 58.17,73.91 57.91,74.17 | 117.86,87.88 122.17,87.88 122.68,87.38 122.68,77.47 118.62,73.41 85.85,73.41 84.96,74.3
  Top 3.81: U$2.A U$2.B 19.56,52.07 26.67,52.07 26.67,43.18 26.67,40.64 S1.2
  Top 6.452: 85.09,69.85 85.09,73.66 83.82,73.66 57.15,73.66 57.15,59.69 85.09,59.69 85.09,64.77 | 85.09,69.85 85.09,64.77 | 58.42,69.85 85.09,69.85 | 85.09,64.77 58.42,64.77 58.42,66.04
5V_OFF
  Top 1.016: R1.2 36.83,45.72 S1.3
+2V
  Top 0.61: U$12.5 93.91,46.67 94.23,46.99 C14.1
  Top 1.27: 94.23,46.99 95.5,45.72 U$14.B U$14.A
+3V3  (via drill 0.6)
  Top 0.61: U$7.6 54.29,91.12 54.61,91.44 C9.1 | R15.2 41.91,91.95 42.67,92.71 42.67,99.57 v42.93,99.82 | v61.72,99.82 63.5,99.82
  Top 1.27: C9.1 62.65,93.13 63.5,93.98 63.5,99.82 U$9.B U$9.A
  Bottom 0.61: v42.93,99.82 v61.72,99.82
+5V
  Top 0.61: U$12.3 89.47,44.77 88.9,44.2 86.61,44.2 86.36,44.45 | 87.8,47.24 88.9,47.24 89.47,46.67 U$12.1 | 87.8,47.24 C13.1 | 87.8,47.24 87.12,47.24 86.36,46.48 86.36,45.72
  Top 1.016: C117.1 59.69,34.29 | C115.1 59.69,31.75 | C116.1 59.69,29.21 | 59.69,40.77 66.04,40.77 C6.1+
  Top 1.27: C6.1+ 66.04,40.64 59.69,40.64
  Top 1.422: L3.1 67.31,33.02 | 67.31,33.02 59.69,33.02 | C30.1 67.31,33.02
  Top 1.676: U$6.2 59.69,40.77 59.69,40.64 59.69,36.83 59.69,34.29 59.69,33.02 59.69,31.75 59.69,29.21 59.69,19.11 U$49.B U$49.A
  Top 1.778: 59.69,36.83 80.01,36.83 86.36,43.18 86.36,44.45 86.36,45.72
+15V
  Top 0.61: D2.C 105.41,87.38 104.14,87.38 | 104.14,87.38 103.89,87.63 | R8.2 103.89,87.12 104.14,87.38
  Top 1.016: C24.1 101.6,87.38 101.85,87.63 102.36,87.63 | 102.36,87.63 103.89,87.63 105.16,87.63 | 102.36,87.63 101.6,88.39 C27.1 101.6,87.63
  Top 1.27: 101.6,87.63 99.31,87.63 98.55,88.39 98.55,98.55 101.35,101.35 107.19,101.35 107.44,101.6 107.44,108.65 U$26.B 108.2,109.41 108.2,109.73 107.95,109.98 U$26.A
+15V_2
  Top 0.61: C31.1 96.52,31.75
  Top 1.27: U$22.5 92.2,31.75 | 92.2,31.75 92.2,33.65 C32.1 | 99.06,31.75 96.52,31.75 92.2,31.75
  Top 1.778: U$24.A U$24.B 119.38,24.13 118.11,25.4 101.6,25.4 100.33,26.67 100.33,30.48 99.06,31.75
-2V
  Top 0.406: 31.5,99.06 31.82,99.06 32.07,98.81
  Top 0.61: U$20.5 32.07,98.81 | 32.07,98.81 32.07,99.13 32.26,99.31 32.85,99.31 R11.2 | C29.2 31.82,98.55 32.07,98.81
  Top 1.27: 31.5,99.06 30.73,99.82 30.73,101.35 29.21,102.87 U$21.B U$21.A
-5V
  Top 0.61: U$16.P$5 20.83,76.2 20.57,76.45 20.57,77.98 21.08,78.49 | U$20.2 33.02,91.44 32.26,90.68 C28.2
  Top 1.27: 21.08,87.88 31.24,87.88 32.26,88.9 32.26,90.68
  Top 1.422: 21.08,78.49 21.08,84.58 | 21.08,84.58 21.08,87.88 20.07,88.9 U$17.B U$17.A | 21.08,84.58 20.83,84.84 6.86,84.84 3.81,81.79 D1.A C21.-
GND  (via drill 0.6)
  Top 0.61: C31.2 v96.52,36.83 | U$12.2 v88.9,45.72 | C13.2 v87.63,50.55 | C14.2 v94.23,51.05 | L2.P$2 16.51,82.04 16.76,82.3 18.8,82.3 19.3,81.79 19.3,75.44 19.81,74.93 U$16.P$6 | C20.2 v11.94,71.88 | R7.2 v36.32,69.85 | C22.2 v38.61,69.85 | C18.2 v30.48,79.5 | C23.2 v27.94,81.28 | U$20.1 32.07,93.03 32,92.96 v30.73,92.96 | C28.1 v28.45,90.68 | C29.1 v25.91,98.55 | R14.1 v39.12,97.28 | C7.2 v54.61,83.82 | C8.2 v49.53,84.07 | U$7.2 v49.28,90.17 | C10.2 v49.53,96.27 | C9.2 v54.61,96.27 | U$10.P$2 v76.2,87.63 | C11.2 v70.36,88.14 | C12.2 v70.61,95 | U$13.2 v89.41,86.11 | C17.2 v95.25,84.58 | R4.1 v95.76,92.71 | U$18.P$2 v107.44,86.36 | R9.1 v105.41,78.99 | C26.2 v117.86,82.3 | C25.2 v114.3,80.26
  Top 1.016: R1.1 v45.72,45.72 | C2.2 v34.29,53.34 | C4.2 v34.29,50.8 | C117.2 v53.34,34.29 | C115.2 v53.34,31.75 | C116.2 v50.8,29.21 | C6.2- v66.04,50.8 | C30.2 v67.31,24.13 | U$22.1 v76.2,7.62 | C33.1 v97.79,7.62 | C34.1 v83.82,6.35 | C27.2 v101.6,94.74
  Top 1.27: U$22.6 89.66,30.99 v88.9,31.75 | C32.2 v92.71,39.37
  Top 1.422: C3.2 v45.72,31.75 | C5.2 v49.53,33.02
  Bottom 0.61: v96.52,36.83 95.25,36.83 | v88.9,45.72 88.65,45.72 | v87.63,50.55 87.38,50.55 | v94.23,51.05 93.47,51.05 | v11.94,71.88 11.94,72.64 | v36.32,69.85 35.56,69.85 | v38.61,69.85 38.1,69.85 | v30.48,79.5 30.48,80.01 | v27.94,81.28 27.43,81.28 | v30.73,92.96 30.73,93.47 | v28.45,90.68 28.45,91.19 | v25.91,98.55 25.91,99.06 | v39.12,97.28 38.61,97.28 | v54.61,83.82 54.1,83.82 | v49.53,84.07 49.02,84.07 | v49.28,90.17 49.28,90.42 | v49.53,96.27 49.28,96.27 | v54.61,96.27 54.36,96.27 | v76.2,87.63 75.69,87.63 | v70.36,88.14 70.36,88.65 | v70.61,95 70.61,95.25 | v89.41,86.11 88.9,86.11 | v95.25,84.58 95.25,85.09 | v95.76,92.71 95.76,92.96 95.5,93.22 | v107.44,86.36 107.19,86.36 | v105.41,78.99 104.65,78.99 | v117.86,82.3 117.09,82.3 | v114.3,80.26 113.54,80.26
  Bottom 1.016: v45.72,45.72 45.72,46.99 | v34.29,53.34 34.29,54.61 | v34.29,50.8 34.29,52.07 | v53.34,34.29 53.34,35.56 | v53.34,31.75 53.34,33.02 | v50.8,29.21 50.8,30.48 | v66.04,50.8 64.77,50.8 | v67.31,24.13 67.31,22.86 | v76.2,7.62 74.93,7.62 | v97.79,7.62 97.79,8.89 | v83.82,6.35 83.82,7.62 | v101.6,94.74 100.84,94.74
  Bottom 1.27: v88.9,31.75 87.63,31.75 | v92.71,39.37 91.44,39.37
  Bottom 1.422: v45.72,31.75 44.45,31.75 | v49.53,33.02 48.26,33.02
  other vias: 63.5,78.74 67.31,78.74 71.12,78.74 74.93,78.74 78.74,78.74 82.55,78.74 82.55,82.55 78.74,82.55 74.93,82.55 63.5,81.28 67.31,81.28 71.12,81.28 88.9,84.84 75.44,86.36 52.07,49.53 52.07,46.99 52.07,44.45 61.72,49.78 61.72,47.24 61.72,44.7 53.34,52.07 55.88,52.07 58.42,52.07 60.96,52.07 53.34,36.83 45.72,48.26 45.72,50.8 45.72,53.34 90.17,52.07 92.71,52.07 85.09,52.07 71.12,29.21 71.12,25.4 71.12,21.59 71.12,17.78 71.12,12.7 71.12,8.89 71.12,5.08 76.2,5.08 80.01,5.08 80.01,7.62 82.55,7.62 82.55,5.08 67.31,5.08 67.31,8.89 67.31,12.7 67.31,17.78 67.31,21.59 99.06,10.16 99.06,13.97 99.06,17.78 99.06,20.32 99.06,22.86 86.36,31.75 83.82,31.75 81.28,31.75 78.74,31.75 81.28,34.29 85.09,34.29 87.63,34.29 85.09,36.83 87.63,39.37 90.17,41.91 95.25,43.18 99.06,43.18 101.6,43.18 97.79,48.26 101.6,48.26 83.82,45.72 81.28,43.18 78.74,41.91 74.93,40.64 71.12,40.64 68.58,50.8 71.12,50.8 71.12,48.26 71.12,45.72 71.12,43.18 63.5,50.8 60.96,54.61 58.42,54.61 55.88,54.61 53.34,54.61 55.88,48.26 58.42,48.26 58.42,45.72 55.88,45.72 10.16,72.39 7.62,74.93 8.89,69.85 16.51,69.85 13.97,69.85 11.43,69.85 7.62,81.28 10.16,81.28 24.13,81.28 24.13,83.82 27.94,83.82 31.75,83.82 31.75,81.28 21.59,68.58 26.67,68.58 26.67,66.04 21.59,66.04 24.13,66.04 24.13,68.58 33.02,69.85 33.02,72.39 33.02,67.31 36.83,67.31 39.37,67.31 33.02,63.5 36.83,63.5 39.37,63.5 36.83,95.25 40.64,95.25 27.94,96.52 27.94,93.98 25.4,96.52 25.4,93.98 33.02,106.68 35.56,106.68 38.1,106.68 40.64,106.68 43.18,106.68 43.18,102.87 36.83,88.9 39.37,88.9 43.18,88.9 45.72,88.9 45.72,91.44 45.72,86.36 45.72,83.82 35.56,87.63 33.02,86.36 45.72,81.28 49.53,81.28 54.61,81.28 52.07,81.28 52.07,83.82 60.96,90.17 60.96,86.36 64.77,86.36 64.77,90.17 68.58,90.17 68.58,86.36 66.04,101.6 66.04,99.06 66.04,96.52 66.04,93.98 73.66,101.6 73.66,97.79 78.74,97.79 78.74,101.6 71.12,92.71 80.01,92.71 80.01,90.17 71.12,90.17 85.09,100.33 85.09,96.52 85.09,92.71 85.09,88.9 82.55,88.9 82.55,92.71 82.55,96.52 82.55,100.33 95.25,96.52 95.25,100.33 95.25,90.17 95.25,87.63 97.79,85.09 97.79,102.87 92.71,88.9 99.06,82.55 96.52,81.28 101.6,96.52 102.87,99.06 105.41,99.06 109.22,100.33 100.33,104.14 99.06,107.95 99.06,111.76 99.06,115.57 99.06,119.38 91.44,80.01 91.44,76.2 97.79,76.2 102.87,76.2 107.95,76.2 113.03,76.2 116.84,77.47 54.61,77.47 50.8,74.93 50.8,72.39 50.8,69.85 50.8,67.31 49.53,64.77 46.99,62.23 45.72,58.42 91.44,69.85 91.44,66.04 91.44,62.23 91.44,58.42 88.9,54.61 81.28,54.61 85.09,54.61 77.47,54.61 73.66,54.61 69.85,54.61 67.31,54.61 64.77,54.61 95.25,69.85 99.06,69.85 102.87,69.85 107.95,69.85 111.76,69.85 115.57,69.85 119.38,69.85 123.19,71.12 124.46,73.66 120.65,91.44 120.65,95.25 124.46,95.25 124.46,91.44 120.65,99.06 124.46,99.06 124.46,102.87 120.65,102.87 116.84,102.87 116.84,99.06 113.03,99.06 113.03,102.87 95.25,66.04 95.25,62.23 95.25,58.42 50.8,78.74 29.21,106.68 25.4,106.68 21.59,96.52 16.51,96.52 11.43,96.52 6.35,96.52 22.86,60.96 22.86,57.15 16.51,57.15 16.51,60.96 3.81,57.15 7.62,57.15 11.43,57.15 3.81,46.99 10.16,46.99 15.24,46.99 20.32,46.99 3.81,38.1 10.16,38.1 15.24,38.1 20.32,38.1 3.81,27.94 10.16,27.94 15.24,27.94 20.32,27.94 53.34,102.87 55.88,102.87 58.42,102.87 59.69,97.79 57.15,97.79 53.34,97.79 50.8,97.79 59.69,95.25 57.15,95.25
  pour Bottom (isolate 0.61): 0,127 127,127 127,0 0,0
  pour Top (isolate 0.61): 0,127 127,127 127,0 0,0
N$1
  Top 1.016: R2.1 LED1.A
N$2
  Top 0.61: U$16.P$7 16.76,73.66 16.26,74.17 16.26,74.68 L2.P$1
  Top 1.422: D1.C 11.43,75.95 12.45,74.93 L2.P$1 17.02,74.93
N$3
  Top 0.61: U$7.3 49.85,89.22 49.53,88.9 C8.1
N$4
  Top 0.61: U$13.4 90.36,90.87 90.68,91.19 90.93,91.19 91.44,91.69 91.44,92.46 | R3.1 90.93,92.71 | 90.93,92.71 91.19,92.71 91.44,92.46 | 91.44,92.46 92.11,92.46 R4.2 | C15.2 90.93,95.25 91.44,94.74 91.44,93.22 90.93,92.71
N$5
  Top 0.61: U$16.P$1 29.21,72.39 29.72,71.88 R5.1
N$6
  Top 0.61: R6.2 36.07,74.42 36.32,74.17 | 36.32,74.17 R7.1 | C22.1 38.61,74.17 38.35,74.42 36.58,74.42 36.32,74.17
N$7
  Top 0.61: U$16.P$2 30.23,73.66 30.48,73.91 C18.1 30.86,74.42 R6.1
N$8
  Top 0.61: U$16.P$4 27.43,76.2 27.94,76.71 C23.1
N$9
  Top 0.61: R13.1 39.37,102.87 39.62,102.62 39.62,100.93 R14.2
N$10
  Top 0.61: U$18.P$1 108.02,87.31 107.7,87.63
  Top 1.016: 107.7,87.63 107.7,93.73 107.95,93.98 | 107.95,93.98 108.2,93.98 L1.P$1 | D2.A 105.41,93.22 106.17,93.98 107.95,93.98
N$12
  Top 0.61: U$18.P$3 108.27,85.41 107.7,84.84 107.7,83.57 107.44,83.31 105.41,83.31 104.14,83.31 | 104.14,83.31 103.63,83.31 | R8.1 103.89,83.57 104.14,83.31
  Top 1.016: 105.41,83.31 105.41,83.06 | 105.41,83.06 R9.2 | C24.2 101.6,83.31 101.85,83.06 105.41,83.06
N$13
  Top 0.61: R12.1 36.07,102.87 | 36.07,102.87 R13.2 | U$20.4 33.97,97.47 34.8,98.3 35.56,98.3 36.07,98.81 36.07,102.87
N$14
  Top 0.61: R10.1 114.3,84.33 | 114.3,84.33 C25.1 | U$18.P$4 112.2,85.41 112.52,85.09 112.52,84.58 112.78,84.33 114.3,84.33
N$15
  Top 0.61: R11.1 33.02,102.45 R12.2
N$16
  Top 0.61: R15.1 34.54,91.95 33.97,92.52 U$20.3
N$17
  Top 1.422: L3.2 76.2,33.02 U$22.8
V+3V
  Top 0.61: U$10.P$5 75.25,94.42 75.18,94.49 74.68,95 C12.1
  Top 1.27: 75.18,94.49 75.18,96.52 76.2,97.54 U$11.B U$11.A
V-5V_2
  Top 1.016: U$22.3 89.66,6.98 | 89.66,6.98 C34.2 | U$22.4 92.2,7.62 | 92.2,7.62 92.2,7.11 91.44,6.35 90.29,6.35 89.66,6.98 | C33.2 92.2,7.62
  Top 1.778: U$23.B U$23.A 93.98,2.54 91.44,5.08 91.44,6.35
V_2P5
  Top 0.61: U$7.1 49.85,91.12 49.53,91.44 C10.1
  Top 1.27: C10.1 47.33,93.13 46.23,94.23 46.23,99.57 49.78,103.12 49.78,108.91 U$8.B U$8.A